# Altium schematic sheet Bank2&3.SchDoc
size A4
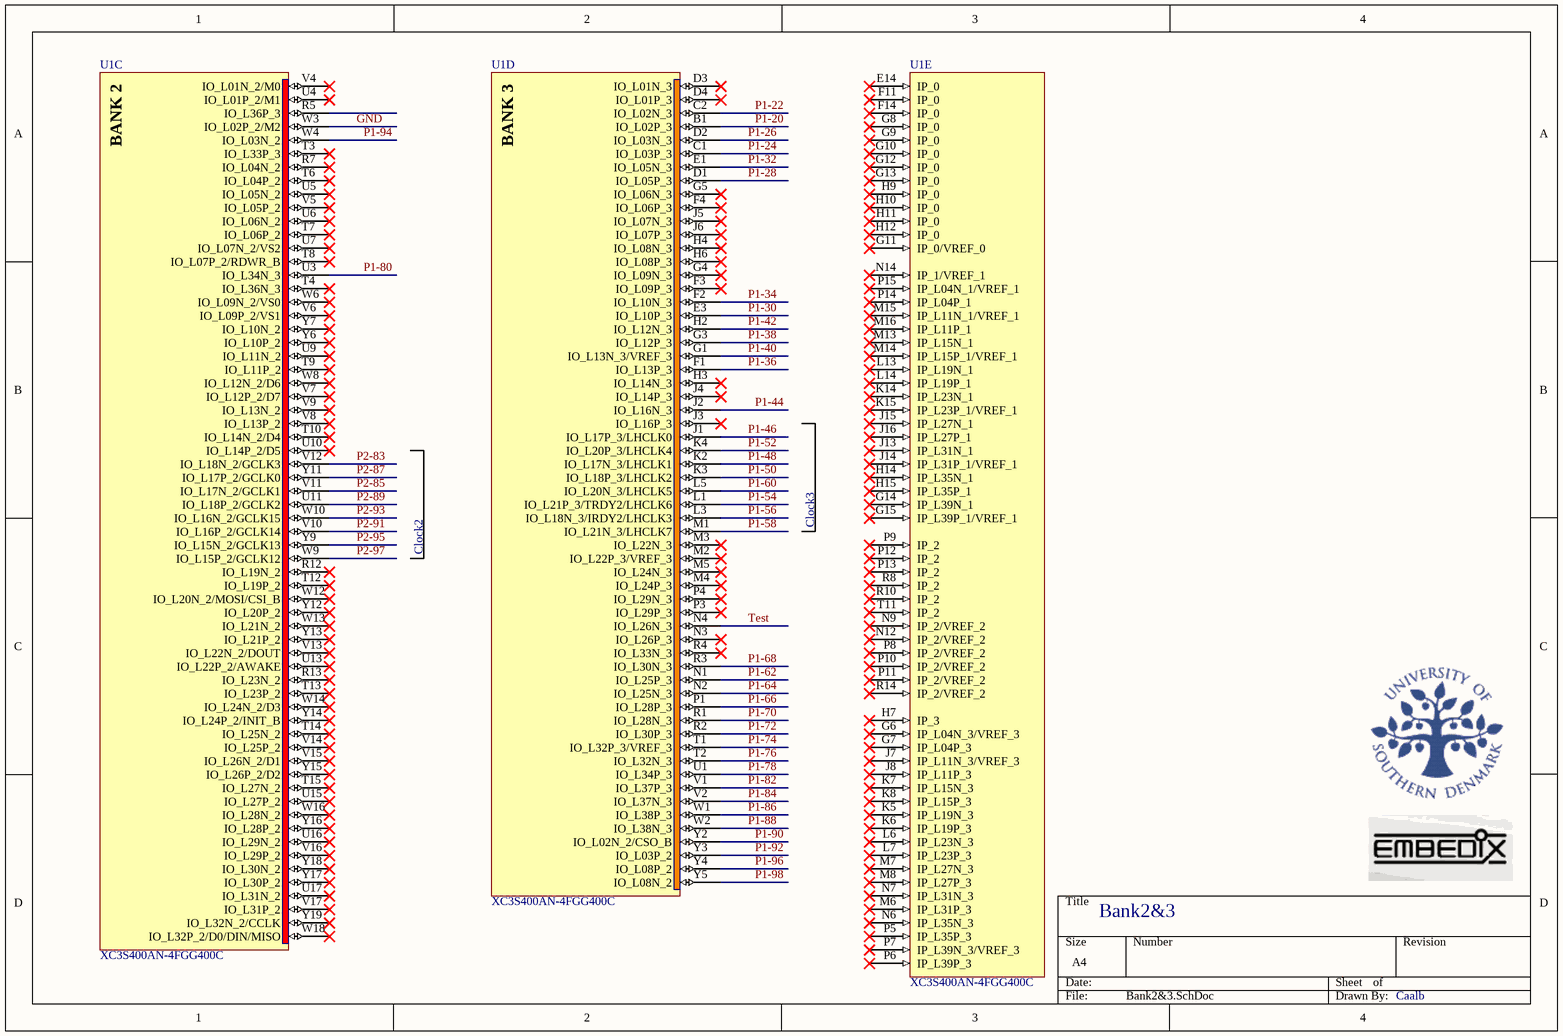
[diagram p0: Bank2&3.SchDoc]

## Parts
U1  XC3S400AN-4FGG400C  [FGG400]  (parts C,D,E of 8)

## Nets
GND: U1.W3(IO_L02P_2/M2)
P1-20: U1.B1(IO_L02P_3)
P1-22: U1.C2(IO_L02N_3)
P1-24: U1.C1(IO_L03P_3)
P1-26: U1.D2(IO_L03N_3)
P1-28: U1.D1(IO_L05P_3)
P1-30: U1.E3(IO_L10P_3)
P1-32: U1.E1(IO_L05N_3)
P1-34: U1.F2(IO_L10N_3)
P1-36: U1.F1(IO_L13P_3)
P1-38: U1.G3(IO_L12P_3)
P1-40: U1.G1(IO_L13N_3/VREF_3)
P1-42: U1.H2(IO_L12N_3)
P1-44: U1.J2(IO_L16N_3)
P1-46: U1.J1(IO_L17P_3/LHCLK0)
P1-48: U1.K2(IO_L17N_3/LHCLK1)
P1-50: U1.K3(IO_L18P_3/LHCLK2)
P1-52: U1.K4(IO_L20P_3/LHCLK4)
P1-54: U1.L1(IO_L21P_3/TRDY2/LHCLK6)
P1-56: U1.L3(IO_L18N_3/IRDY2/LHCLK3)
P1-58: U1.M1(IO_L21N_3/LHCLK7)
P1-60: U1.L5(IO_L20N_3/LHCLK5)
P1-62: U1.N1(IO_L25P_3)
P1-64: U1.N2(IO_L25N_3)
P1-66: U1.P1(IO_L28P_3)
P1-68: U1.R3(IO_L30N_3)
P1-70: U1.R1(IO_L28N_3)
P1-72: U1.R2(IO_L30P_3)
P1-74: U1.T1(IO_L32P_3/VREF_3)
P1-76: U1.T2(IO_L32N_3)
P1-78: U1.U1(IO_L34P_3)
P1-80: U1.U3(IO_L34N_3)
P1-82: U1.V1(IO_L37P_3)
P1-84: U1.V2(IO_L37N_3)
P1-86: U1.W1(IO_L38P_3)
P1-88: U1.W2(IO_L38N_3)
P1-90: U1.Y2(IO_L02N_2/CSO_B)
P1-92: U1.Y3(IO_L03P_2)
P1-94: U1.W4(IO_L03N_2)
P1-96: U1.Y4(IO_L08P_2)
P1-98: U1.Y5(IO_L08N_2)
P2-83: U1.V12(IO_L18N_2/GCLK3)
P2-85: U1.V11(IO_L17N_2/GCLK1)
P2-87: U1.Y11(IO_L17P_2/GCLK0)
P2-89: U1.U11(IO_L18P_2/GCLK2)
P2-91: U1.V10(IO_L16P_2/GCLK14)
P2-93: U1.W10(IO_L16N_2/GCLK15)
P2-95: U1.Y9(IO_L15N_2/GCLK13)
P2-97: U1.W9(IO_L15P_2/GCLK12)
Test: U1.N4(IO_L26N_3)

Not connected (* = marked no-connect by the designer): U1 D3(IO_L01N_3)* D4(IO_L01P_3)* E14(IP_0)* F3(IO_L09P_3)* F4(IO_L06P_3)* F11(IP_0)* F14(IP_0)* G4(IO_L09N_3)* G5(IO_L06N_3)* G6(IP_L04N_3/VREF_3)* G7(IP_L04P_3)* G8(IP_0)* G9(IP_0)* G10(IP_0)* G11(IP_0/VREF_0)* G12(IP_0)* G13(IP_0)* G14(IP_L39N_1)* G15(IP_L39P_1/VREF_1)* H3(IO_L14N_3)* H4(IO_L08N_3)* H6(IO_L08P_3)* H7(IP_3)* H9(IP_0)* H10(IP_0)* H11(IP_0)* H12(IP_0)* H14(IP_L35N_1)* H15(IP_L35P_1)* J3(IO_L16P_3)* J4(IO_L14P_3)* J5(IO_L07N_3)* J6(IO_L07P_3)* J7(IP_L11N_3/VREF_3)* J8(IP_L11P_3)* J13(IP_L31N_1)* J14(IP_L31P_1/VREF_1)* J15(IP_L27N_1)* J16(IP_L27P_1)* K5(IP_L19N_3)* K6(IP_L19P_3)* K7(IP_L15N_3)* K8(IP_L15P_3)* K14(IP_L23N_1)* K15(IP_L23P_1/VREF_1)* L6(IP_L23N_3)* L7(IP_L23P_3)* L13(IP_L19N_1)* L14(IP_L19P_1)* M2(IO_L22P_3/VREF_3)* M3(IO_L22N_3)* M4(IO_L24P_3)* M5(IO_L24N_3)* M6(IP_L31P_3)* M7(IP_L27N_3)* M8(IP_L27P_3)* M13(IP_L15N_1)* M14(IP_L15P_1/VREF_1)* M15(IP_L11N_1/VREF_1)* M16(IP_L11P_1)* N3(IO_L26P_3)* N6(IP_L35N_3)* N7(IP_L31N_3)* N9(IP_2/VREF_2)* N12(IP_2/VREF_2)* N14(IP_1/VREF_1)* P3(IO_L29P_3)* P4(IO_L29N_3)* P5(IP_L35P_3)* P6(IP_L39P_3)* P7(IP_L39N_3/VREF_3)* P8(IP_2/VREF_2)* P9(IP_2)* P10(IP_2/VREF_2)* P11(IP_2/VREF_2)* P12(IP_2)* P13(IP_2)* P14(IP_L04P_1)* P15(IP_L04N_1/VREF_1)* R4(IO_L33N_3)* R5(IO_L36P_3) R7(IO_L04N_2)* R8(IP_2)* R10(IP_2)* R12(IO_L19N_2)* R13(IO_L23N_2)* R14(IP_2/VREF_2)* T3(IO_L33P_3)* T4(IO_L36N_3)* T6(IO_L04P_2)* T7(IO_L06P_2)* T8(IO_L07P_2/RDWR_B)* T9(IO_L11P_2)* T10(IO_L14N_2/D4)* T11(IP_2)* T12(IO_L19P_2)* T13(IO_L23P_2)* T14(IO_L25N_2)* T15(IO_L27N_2)* U4(IO_L01P_2/M1)* U5(IO_L05N_2)* U6(IO_L06N_2)* U7(IO_L07N_2/VS2)* U9(IO_L11N_2)* U10(IO_L14P_2/D5)* U13(IO_L22P_2/AWAKE)* U15(IO_L27P_2)* U16(IO_L29N_2)* U17(IO_L31N_2)* V4(IO_L01N_2/M0)* V5(IO_L05P_2)* V6(IO_L09P_2/VS1)* V7(IO_L12P_2/D7)* V8(IO_L13P_2)* V9(IO_L13N_2)* V13(IO_L22N_2/DOUT)* V14(IO_L25P_2)* V15(IO_L26N_2/D1)* V16(IO_L29P_2)* V17(IO_L31P_2)* W6(IO_L09N_2/VS0)* W8(IO_L12N_2/D6)* W12(IO_L20N_2/MOSI/CSI_B)* W13(IO_L21N_2)* W14(IO_L24N_2/D3)* W16(IO_L28N_2)* W18(IO_L32P_2/D0/DIN/MISO)* Y6(IO_L10P_2)* Y7(IO_L10N_2)* Y12(IO_L20P_2)* Y13(IO_L21P_2)* Y14(IO_L24P_2/INIT_B)* Y15(IO_L26P_2/D2)* Y16(IO_L28P_2)* Y17(IO_L30P_2)* Y18(IO_L30N_2)* Y19(IO_L32N_2/CCLK)*

## Notes on the sheet
- Clock2
- Clock3
- Bank2&3
- Caalb
- (in symbol XC3S400AN-4FGG400C, part C) BANK 2
- (in symbol XC3S400AN-4FGG400C, part D) BANK 3

## Library data of the parts
U1 = XC3S400AN-4FGG400C: Spartan-3AN Non-Volatile FPGA, 311 User I/Os, 400-Pin FBGA, Standard Performance, Commercial Grade, Pb-Free; Published: 20-Jul-2007; DatasheetVersion: 26-Feb-2007; PackageVersion: ver1.0, Mar-2005; PackageReference: FGG400; Publisher: Altium Limited; PackageDescription: 400-Ball Fine Pitch Ball Grid Array 1.00 mm Pitch (FGG400) - Pb-Free; Code_JEDEC: MS-034-AAH-1; Code_IPC: BGA100P20X20-400; ComponentLink1Description: Manufacturer Link; ComponentLink1URL: http://www.xilinx.com/products/silicon_solutions/fpgas/spartan_series/spartan3an_fpgas/index.htm; ComponentLink2Description: Datasheet; ComponentLink2URL: http://direct.xilinx.com/bvdocs/publications/ds557.pdf